# EAGLE design controller pcb (EAGLE 9.3.0)
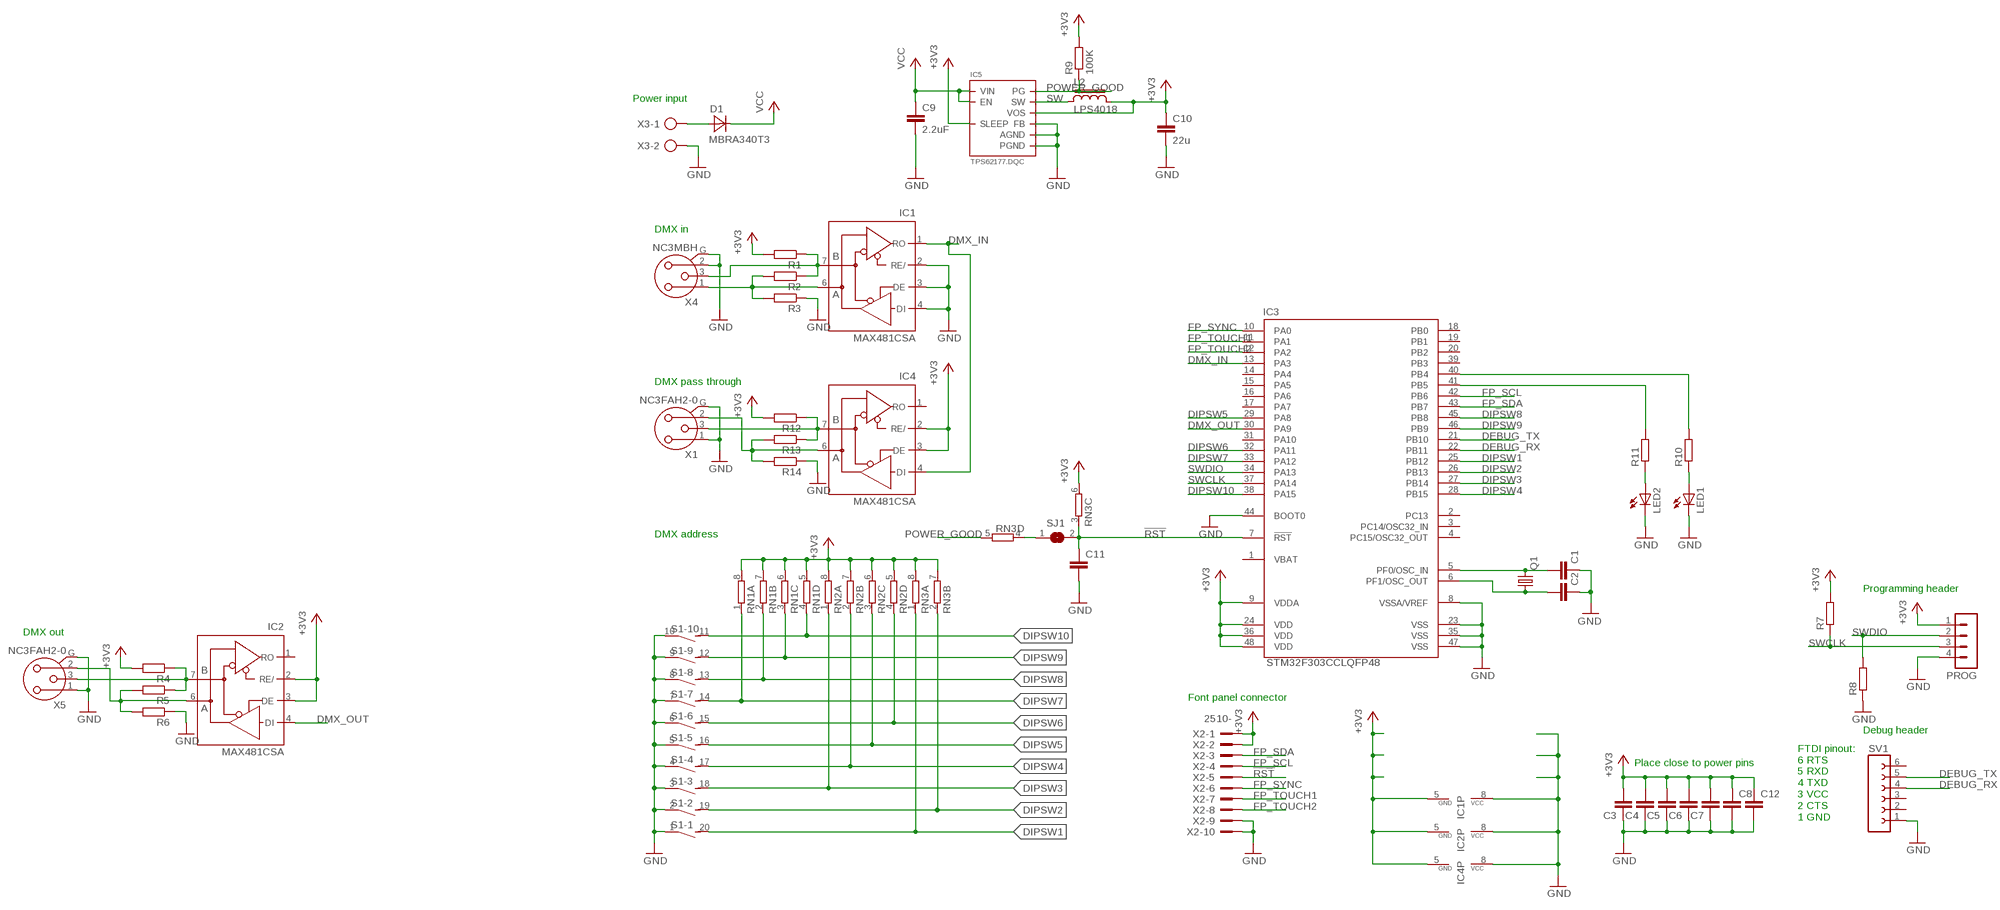
[diagram p0: schematic, sheet 1]

## Parts
C1  C-EUC0603K  [C0603K]
C2  C-EUC0603K  [C0603K]
C3  C-EUC0603K  [C0603K]
C4  C-EUC0603K  [C0603K]
C5  C-EUC0603K  [C0603K]
C6  C-EUC0603K  [C0603K]
C7  C-EUC0603K  [C0603K]
C8  C-EUC0603K  [C0603K]
C9  2.2uF  C-EUC1206  [C1206]
C10  22u  C-EUC1206  [C1206]
C11  C-EUC0603K  [C0603K]
C12  C-EUC0603K  [C0603K]
D1  MBRA340T3  [SMA]
IC1  MAX481CSA  [SO08]
IC2  MAX481CSA  [SO08]
IC3  STM32F303CCLQFP48  [LQFP48]
IC4  MAX481CSA  [SO08]
IC5  TPS62177.DQC  [DQC]
L2  LPS4018  [LPS4018]
LED1  LEDCHIPLED_1206  [CHIPLED_1206]
LED2  LEDCHIPLED_1206  [CHIPLED_1206]
PROG  MA04-1  [MA04-1]
Q1  CRYSTALCTS406  [CTS406]
R1  R-EU_R0603  [R0603]
R2  R-EU_R0603  [R0603]
R3  R-EU_R0603  [R0603]
R4  R-EU_R0603  [R0603]
R5  R-EU_R0603  [R0603]
R6  R-EU_R0603  [R0603]
R7  R-EU_R0603  [R0603]
R8  R-EU_R0603  [R0603]
R9  100K  R-EU_R0603  [R0603]
R10  R-EU_R0603  [R0603]
R11  R-EU_R0603  [R0603]
R12  R-EU_R0603  [R0603]
R13  R-EU_R0603  [R0603]
R14  R-EU_R0603  [R0603]
RN1  4R-NCAY16  [CAY16]
RN2  4R-NCAY16  [CAY16]
RN3  4R-NCAY16  [CAY16]
S1  DIP10SB  [DIP10SB]
SJ1  SJ  [SJ]
SV1  FE06-1  [FE06]
X1  NC3FAH2-0  [NC3FAH2-0]
X2  2510-  [PAK100/2500-10]
X3  AK500/2  [AK500/2]
X4  NC3MBH  [NC3MBH]
X5  NC3FAH2-0  [NC3FAH2-0]

## Nets
!RST: C11.1 IC3.7(!RST) RN3.3 SJ1.2 X2.5
+3V3: C3.2 C4.2 C5.2 C6.2 C7.2 C8.1 C10.1 C12.1 IC1.5(GND) IC2.2(RE/) IC2.3(DE) IC2.5(GND) IC3.9(VDDA) IC3.24(VDD) IC3.36(VDD) IC3.48(VDD) IC4.2(RE/) IC4.3(DE) IC4.5(GND) IC5.8(SLEEP) IC5.10(VOS) L2.2 PROG.1 R1.2 R4.2 R7.2 R9.2 R12.2 RN1.5 RN1.6 RN1.7 RN1.8 RN2.5 RN2.6 RN2.7 RN2.8 RN3.6 RN3.7 RN3.8 X2.1 X2.2
DEBUG_RX: IC3.22(PB11) SV1.4
DEBUG_TX: IC3.21(PB10) SV1.5
DIPSW1: IC3.25(PB12) RN3.1 S1.20
DIPSW2: IC3.26(PB13) RN3.2 S1.19
DIPSW3: IC3.27(PB14) RN2.1 S1.18
DIPSW4: IC3.28(PB15) RN2.2 S1.17
DIPSW5: IC3.29(PA8) RN2.3 S1.16
DIPSW6: IC3.32(PA11) RN2.4 S1.15
DIPSW7: IC3.33(PA12) RN1.1 S1.14
DIPSW8: IC3.45(PB8) RN1.2 S1.13
DIPSW9: IC3.46(PB9) RN1.3 S1.12
DIPSW10: IC3.38(PA15) RN1.4 S1.11
DMX_IN: IC1.1(RO) IC3.13(PA3) IC4.4(DI)
DMX_OUT: IC2.4(DI) IC3.30(PA9)
FP_SCL: IC3.42(PB6) X2.4
FP_SDA: IC3.43(PB7) X2.3
FP_SYNC: IC3.10(PA0) X2.6
FP_TOUCH1: IC3.11(PA1) X2.7
FP_TOUCH2: IC3.12(PA2) X2.8
GND: C1.1 C2.1 C3.1 C4.1 C5.1 C6.1 C7.1 C8.2 C9.2 C10.2 C11.2 C12.2 IC1.2(RE/) IC1.3(DE) IC1.4(DI) IC1.8(VCC) IC2.8(VCC) IC3.8(VSSA/VREF) IC3.23(VSS) IC3.35(VSS) IC3.44(BOOT0) IC3.47(VSS) IC4.8(VCC) IC5.1(PGND) IC5.5(FB) IC5.6(AGND) IC5.PAD(PGND) LED1.C LED2.C PROG.4 R3.1 R6.1 R8.1 R14.1 S1.1 S1.2 S1.3 S1.4 S1.5 S1.6 S1.7 S1.8 S1.9 S1.10 SV1.1 X1.1 X1.G X2.9 X2.10 X3.2 X4.2 X4.G X5.1 X5.G
N$1: D1.A X3.1
N$2: IC4.6(A) R13.2 R14.2 X1.2
N$3: IC1.7(B) R1.1 R2.1 X4.3
N$4: C2.2 IC3.6(PF1/OSC_OUT) Q1.1
N$5: C1.2 IC3.5(PF0/OSC_IN) Q1.3
N$6: IC1.6(A) R2.2 R3.2 X4.1
N$7: IC2.6(A) R5.2 R6.2 X5.2
N$8: IC2.7(B) R4.1 R5.1 X5.3
N$9: LED1.A R10.1
N$10: LED2.A R11.1
N$11: IC4.7(B) R12.1 R13.1 X1.3
N$12: IC3.41(PB5) R11.2
N$13: IC3.40(PB4) R10.2
N$14: RN3.4 SJ1.1
POWER_GOOD: IC5.7(PG) R9.1 RN3.5
SW: IC5.9(SW) L2.1
SWCLK: IC3.37(PA14) PROG.3 R7.1
SWDIO: IC3.34(PA13) PROG.2 R8.2
VCC: C9.1 D1.C IC5.2(VIN) IC5.3(EN)
Unconnected: IC2.1(RO) IC3.1(VBAT) IC3.2(PC13) IC3.3(PC14/OSC32_IN) IC3.4(PC15/OSC32_OUT) IC3.14(PA4) IC3.15(PA5) IC3.16(PA6) IC3.17(PA7) IC3.18(PB0) IC3.19(PB1) IC3.20(PB2) IC3.31(PA10) IC3.39(PB3) IC4.1(RO) SV1.2 SV1.3 SV1.6

## Notes on the sheet
- Power input
- DMX in
- DMX pass through
- DMX address
- Programming header
- DMX out
- Font panel connector
- Debug header
- Place close to power pins
- FTDI pinout:
  6 RTS
  5 RXD
  4 TXD
  3 VCC
  2 CTS
  1 GND

## Library data of the parts
C1-C12 = rcl:C-EU: CAPACITOR, European symbol; SPICEPREFIX: C
D1 = diode:MBRA340T3: Surface Mount Schottky Power Rectifier Source: http://www.onsemi.com/pub_link/Collateral/MBRA340T3-D.PDF
IC1 IC2 IC4 = maxim:MAX481CSA: RS485 TRANSEIVER; MF: MAXIM; MPN: MAX481CSA; OC_FARNELL: unknown; OC_NEWARK: 90C3817
IC3 = comp:STM32F303CC
IC5 = packages(ti):TPS62177
L2 = inductor-coilcraft:LPS4018: POWER INDUCTOR
LED1 LED2 = led:LED: LED OSRAM: - CHIPLED LG R971, LG N971, LY N971, LG Q971, LY Q971, LO R971, LY R971 LH N974, LH R974 LS Q976, LO Q976, LY Q976 LO Q996 - Hyper CHIPLED LW Q18S LB Q993, LB Q99A, LB R99A - SideLED LS A670, LO A670, LY A670, LG A670, LP A670 LB A673, LV A673, LT A673, LW A673 LH A674 LY A675 LS A676, LA A676, LO A676, LY A676, LW A676 LS A679, LY A679, LG A679 - Hyper Micro SIDELED® LS Y876, LA Y876, LO Y876, LY Y876 LT Y87S - SmartLED LW L88C, LW L88S LB L89C, LB L89S, LG L890 LS L89K, LO L89K, LY L89K LS L896, LA L896, LO L896, LY L896 - TOPLED LS T670, LO T670, LY T670, LG T670, LP T670 LSG T670, LSP T670, LSY T670, LOP T670, LYG T670 LG T671, LOG T671, LSG T671 LB T673, LV T673, LT T673, LW T673 LH T674 LS T676, LA T676, LO T676, LY T676, LB T676, LH T676, LSB T676, LW T676 LB T67C, LV T67C, LT T67C, LS T67K, LO T67K, LY T67K, LW E67C LS E67B, LA E67B, LO E67B, LY E67B, LB E67C, LV E67C, LT E67C LW T67C LS T679, LY T679, LG T679 LS T770, LO T770, LY T770, LG T770, LP T770 LB T773, LV T773, LT T773, LW T773 LH T774 LS E675, LA E675, LY E675, LS T675 LS T776, LA T776, LO T776, LY T776, LB T776 LHGB T686 LT T68C, LB T68C - Hyper Mini TOPLED® LB M676 - Mini TOPLED Santana® LG M470 LS M47K, LO M47K, LY M47K Source: http://www.osram.convergy.de LUXEON: - LUMILED® LXK2-PW12-R00, LXK2-PW12-S00, LXK2-PW14-U00, LXK2-PW14-V00 LXK2-PM12-R00, LXK2-PM12-S00, LXK2-PM14-U00 LXK2-PE12-Q00, LXK2-PE12-R00, LXK2-PE12-S00, LXK2-PE14-T00, LXK2-PE14-U00 LXK2-PB12-K00, LXK2-PB12-L00, LXK2-PB12-M00, LXK2-PB14-N00, LXK2-PB14-P00, LXK2-PB14-Q00 LXK2-PR12-L00, LXK2-PR12-M00, LXK2-PR14-Q00, LXK2-PR14-R00 LXK2-PD12-Q00, LXK2-PD12-R00, LXK2-PD12-S00 LXK2-PH12-R00, LXK2-PH12-S00 LXK2-PL12-P00, LXK2-PL12-Q00, LXK2-PL12-R00 Source: www.luxeon.com KINGBRIGHT: KA-3528ASYC Source: www.kingbright.com
PROG = con-lstb:MA04-1: PIN HEADER; OC_FARNELL: unknown; OC_NEWARK: unknown
Q1 = crystal:CRYSTAL: CRYSTAL; OC_FARNELL: unknown; OC_NEWARK: unknown
R1-R14 = rcl:R-EU_: RESISTOR, European symbol; SPICEPREFIX: R
RN1-RN3 = resistor-dil:4R-N: Array Chip Resistor Source: RS Component / Phycomp; OC_FARNELL: unknown; OC_NEWARK: unknown
S1 = switch-dil:DIP10SB: DIL/CODE SWITCH; OC_FARNELL: unknown; OC_NEWARK: unknown
SJ1 = jumper:SJ: SMD solder JUMPER
SV1 = con-lsta:FE06-1: FEMALE HEADER; OC_FARNELL: unknown; OC_NEWARK: unknown
X1 X5 = con-neutrik_ag:NC3: Neutrik Audio Connector XLR SERIES Stereo 1/4" jack Source: www.neutrik.com/; MPN: NC3FAH-2-0; OC_FARNELL: unknown; OC_NEWARK: 11J5829
X2 = con-3m:2510-: 3M (TM) Pak 100 4-Wall Header Source: 3M; MF: 3M; MPN: 2510-6002UB; OC_FARNELL: 9838244; OC_NEWARK: 46F4725
X3 = con-ptr500:AK500/2: CONNECTOR; OC_FARNELL: unknown; OC_NEWARK: unknown
X4 = con-neutrik_ag:NC3: Neutrik Audio Connector XLR SERIES Stereo 1/4" jack Source: www.neutrik.com/; MF: NEUTRIK; MPN: NC3MBH; OC_FARNELL: unknown; OC_NEWARK: 91F3470

## Board
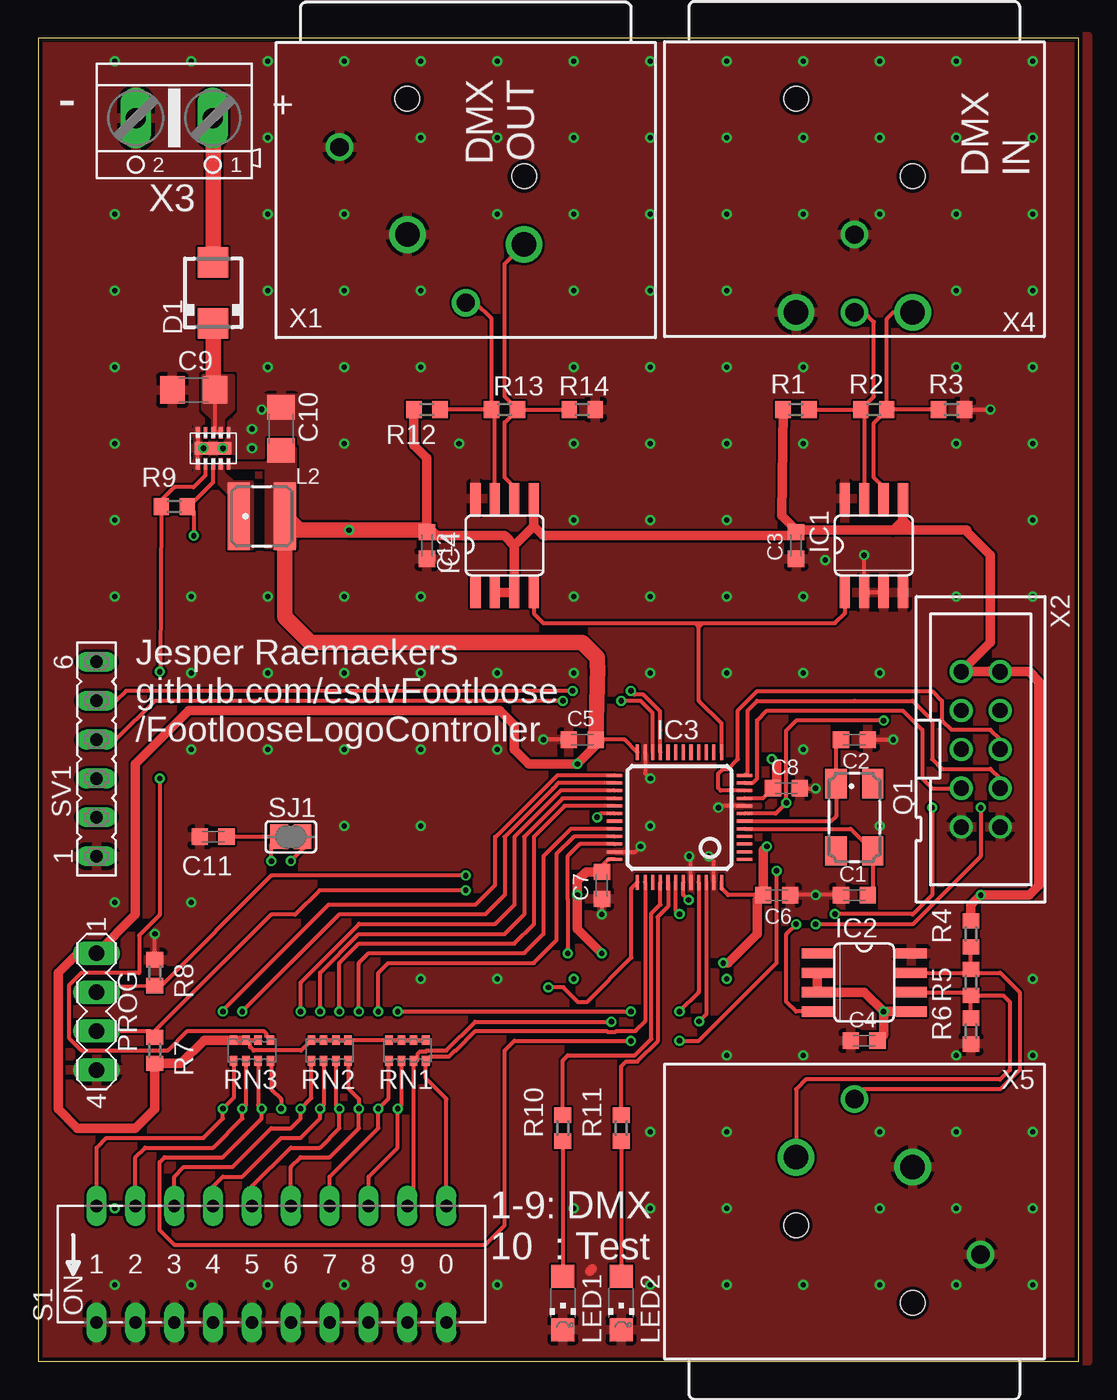
[diagram p1: board, top side]
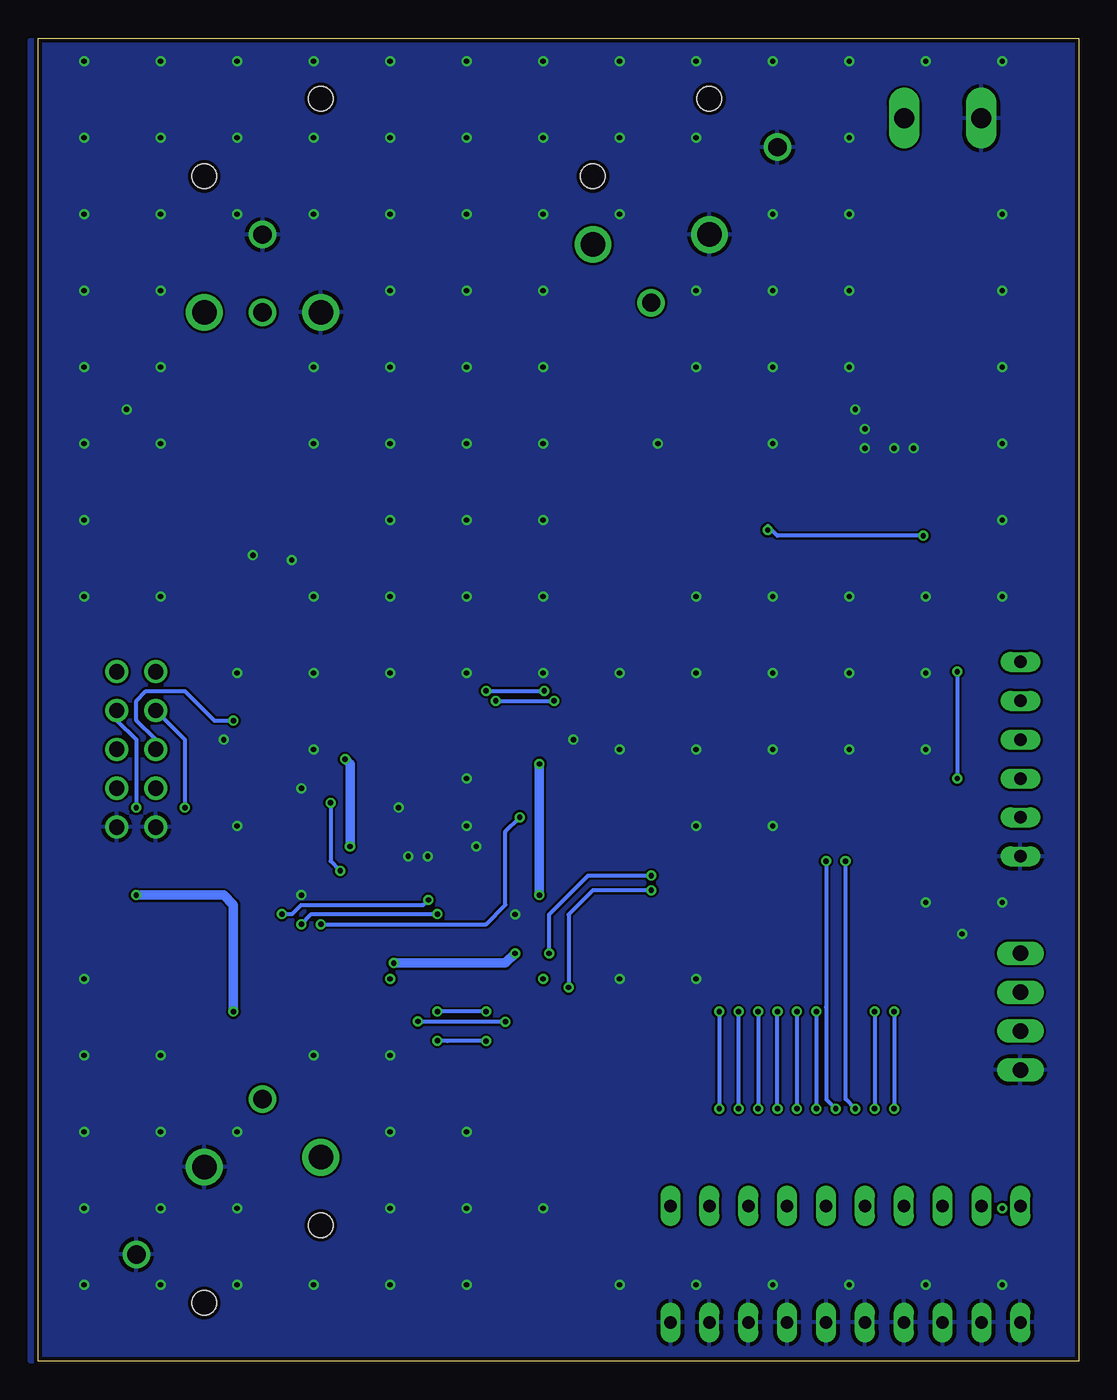
[diagram p2: board, bottom side, seen from below]

Size 68 x 86.5 mm. Coordinates in mm from the lower left corner, seen from the top.
Outline: 0,0 68,0 68,86.5 0,86.5 0,0
Copper layers (1*16): Top 0.035mm / dielectric 1.5mm / Bottom 0.035mm
Design rules "SeeedStudio_2layer_DRU_no_angle_20140221": minimum track width 6mil, minimum drill 12mil, track to track 6mil, track to pad 6mil, pad to pad 6mil, via to via 6mil, smd to smd 0mil, copper to edge 10mil, drill to drill 10mil, minimum pad ring 10mil, minimum via ring 6mil, stop-mask expansion 2mil, vias tented up to drill 100mil, thermal gap 10mil

### Footprints (pad centres in the part's own frame; a part is rotated, then mirrored left to right if it is on the bottom)
C0603K = smd 1.05 x 1.08: 1 -0.875,0; 2 0.875,0
C1206 = smd 1.6 x 1.8: 1 -1.4,0; 2 1.4,0
SMA = smd 2 x 2: A 2,0; C -2,0
SO08 = smd 0.66 x 2.032: 1 -1.905,-3.073; 2 -0.635,-3.073; 3 0.635,-3.073; 4 1.905,-3.073; 5 1.905,3.073; 6 0.635,3.073; 7 -0.635,3.073; 8 -1.905,3.073
LQFP48 = smd 0.2 x 1: 1 -2.75,-4.25; 2 -2.25,-4.25; 3 -1.75,-4.25; 4 -1.25,-4.25; 5 -0.75,-4.25; 6 -0.25,-4.25; 7 0.25,-4.25; 8 0.75,-4.25; 9 1.25,-4.25; 10 1.75,-4.25; 11 2.25,-4.25; 12 2.75,-4.25; 25 2.75,4.25; 26 2.25,4.25; 27 1.75,4.25; 28 1.25,4.25; 29 0.75,4.25; 30 0.25,4.25; 31 -0.25,4.25; 32 -0.75,4.25; 33 -1.25,4.25; 34 -1.75,4.25; 35 -2.25,4.25; 36 -2.75,4.25 | smd 1 x 0.2: 13 4.25,-2.75; 14 4.25,-2.25; 15 4.25,-1.75; 16 4.25,-1.25; 17 4.25,-0.75; 18 4.25,-0.25; 19 4.25,0.25; 20 4.25,0.75; 21 4.25,1.25; 22 4.25,1.75; 23 4.25,2.25; 24 4.25,2.75; 37 -4.25,2.75; 38 -4.25,2.25; 39 -4.25,1.75; 40 -4.25,1.25; 41 -4.25,0.75; 42 -4.25,0.25; 43 -4.25,-0.25; 44 -4.25,-0.75; 45 -4.25,-1.25; 46 -4.25,-1.75; 47 -4.25,-2.25; 48 -4.25,-2.75
DQC = smd 0.75 x 0.25: 1 -1.025,1; 2 -1.025,0.5; 3 -1.025,0; 4 -1.025,-0.5; 5 -1.025,-1; 6 1.025,-1; 7 1.025,-0.5; 8 1.025,0; 9 1.025,0.5; 10 1.025,1 | smd 0.84 x 2.4: PAD 0,0
LPS4018 = smd 1.45 x 4.4: 1 -1.5,0; 2 1.5,0
CHIPLED_1206 = smd 1.5 x 1.5: A 0,-1.75; C 0,1.75
MA04-1 = drill 1.016 long: 1 -3.81,0; 2 -1.27,0; 3 1.27,0; 4 3.81,0
CTS406 = smd 1.9 x 1.4: 1 -2.2,-1.2; 2 2.2,-1.2; 3 2.2,1.2; 4 -2.2,1.2
R0603 = smd 1 x 1.1: 1 -0.85,0; 2 0.85,0
CAY16 = smd 0.5 x 0.65: 1 -1.2,-0.675; 2 -0.4,-0.675; 3 0.4,-0.675; 4 1.2,-0.675; 5 1.2,0.675; 6 0.4,0.675; 7 -0.4,0.675; 8 -1.2,0.675
DIP10SB = drill 0.813 long: 1 -11.43,-3.81; 2 -8.89,-3.81; 3 -6.35,-3.81; 4 -3.81,-3.81; 5 -1.27,-3.81; 6 1.27,-3.81; 7 3.81,-3.81; 8 6.35,-3.81; 9 8.89,-3.81; 10 11.43,-3.81; 11 11.43,3.81; 12 8.89,3.81; 13 6.35,3.81; 14 3.81,3.81; 15 1.27,3.81; 16 -1.27,3.81; 17 -3.81,3.81; 18 -6.35,3.81; 19 -8.89,3.81; 20 -11.43,3.81
SJ = smd 1.168 x 1.6: 1 -0.762,0; 2 0.762,0
FE06 = drill 0.813 long: 1 -6.35,0; 2 -3.81,0; 3 -1.27,0; 4 1.27,0; 5 3.81,0; 6 6.35,0
NC3FAH2-0 = drill 1.6: 1 -3.81,0.635; 2 3.81,0 | drill 1.2: 3 0,-3.815; G -8.25,6.355 | hole 1.6: -3.81,9.525; 3.81,4.445
PAK100/2500-10 = drill 1 pad 1.422: 1 -5.08,-1.27; 2 -5.08,1.27; 3 -2.54,-1.27; 4 -2.54,1.27; 5 0,-1.27; 6 0,1.27; 7 2.54,-1.27; 8 2.54,1.27; 9 5.08,-1.27; 10 5.08,1.27
AK500/2 = drill 1.321 long: 1 -2.515,0; 2 2.515,0
NC3MBH = drill 1.6: 1 3.81,0; 2 -3.81,0 | drill 1.2: 3 0,0; G 0,5.08 | hole 1.6: -3.81,13.97; 3.81,8.89

### Placement (x,y rotation side)
C1  53.34,30.48 0 top
C2  53.34,40.64 180 top
C3  49.53,53.34 90 top
C4  53.98,20.95 0 top
C5  35.56,40.64 0 top
C6  48.26,30.48 180 top
C7  36.83,31.11 90 top
C8  48.9,37.47 0 top
C9  10.16,63.5 180 top
C10  15.88,60.96 90 top
C11  11.43,34.29 180 top
C12  25.4,53.34 270 top
D1  11.43,69.85 90 top
IC1  54.61,53.34 0 top
IC2  53.98,24.77 270 top
IC3  41.91,35.56 90 top
IC4  30.48,53.34 0 top
IC5  11.43,59.69 270 top
L2  14.61,55.24 0 top
LED1  34.29,3.81 180 top
LED2  38.1,3.81 180 top
PROG  3.81,22.86 270 top
Q1  53.34,35.56 270 top
R1  49.53,62.23 180 top
R2  54.61,62.23 0 top
R3  59.69,62.23 180 top
R4  60.96,27.94 90 top
R5  60.96,24.77 270 top
R6  60.96,21.59 90 top
R7  7.62,20.32 270 top
R8  7.62,25.4 270 top
R9  8.89,55.88 0 top
R10  34.29,15.24 90 top
R11  38.1,15.24 90 top
R12  25.4,62.23 180 top
R13  30.48,62.23 0 top
R14  35.56,62.23 180 top
RN1  24.13,20.32 0 top
RN2  19.05,20.32 0 top
RN3  13.97,20.32 0 top
S1  15.24,6.35 0 top
SJ1  16.51,34.29 180 top
SV1  3.81,39.37 90 top
X1  27.94,73.03 0 top
X2  61.59,40.01 270 top
X3  8.89,81.28 180 top
X4  53.34,68.58 0 top
X5  53.34,13.34 180 top

### Tracks (layer width: path | path; a pad name or v marks a point on that pad's centre or on a via)
!RST  (via drill 0.35)
  Top 0.254: v15.24,32.7 15.24,33.78 SJ1.2 C11.1 | RN3.3 14.37,16.75 v14.61,16.51 14.61,15.88 12.06,13.34 8.26,13.34 7.94,13.02 7.94,8.57 8.89,7.62 29.21,7.62 30.48,8.89 30.48,20.32 31.11,20.95 31.14,20.93 v38.73,20.93 | v41.91,20.95 43.18,20.95 48.26,26.04 v48.26,32.07 | IC3.7 48.19,35.81 v48.9,36.51 48.9,41.25 49.53,41.89 v55.24,41.89
  Bottom 0.254: v48.9,36.51 48.9,32.7 v48.26,32.07 | v14.61,16.51 15.24,17.14 v15.24,32.7 | v38.73,20.93 41.25,20.93 41.27,20.95 v41.91,20.95 | X2.5 60.33,40.64 61.59,41.91 61.59,43.18 60.96,43.81 58.42,43.81 56.49,41.89 v55.24,41.89
+3V3  (via drill 0.35)
  Top 0.254: RN1.5 RN1.6 RN1.7 RN1.8 RN2.5 RN2.6 RN2.7 RN2.8 17.18,20.32 14.07,20.32 13.84,20.55 13.84,20.72 RN3.7 RN3.6 | IC5.8 11.43,57.47 9.84,55.88 R9.2 10.16,55.56 v10.16,53.98 | IC3.48 44.66,30.91 45.09,30.48 C6.2 | IC3.24 38.33,40.64 C5.2 | IC3.36 37.26,32.81 36.83,32.38 C7.2 | IC3.9 47.37,36.81 C8.1 48.26,37.7 | IC4.3 31.11,50.8
  Top 0.61: C5.2 36.7,40.51 v35.24,39.05 32.07,39.05 31.11,40.01 31.11,41.59 30.16,42.55 9.84,42.55 6.35,39.05 6.35,29.21 PROG.1 2.59,26.67 1.32,25.4 1.32,16.51 2.54,15.24 6.35,15.24 7.62,16.51 R7.2 9.31,19.47 10.84,21 RN3.8 RN3.7 | v44.77,26.04 45.09,26.04 46.99,27.94 46.99,30.21 C6.2 47.38,33.41 v47.62,33.66 | R1.2 48.58,55.29 49.53,54.34 C3.2 | 57.15,54.34 60.69,54.34 60.64,54.29 62.23,52.7 62.23,46.99 X2.1 X2.2 64.77,45.09 65.41,44.45 65.41,31.11 64.77,30.48 v61.59,30.48 60.96,29.84 R4.2 | 57.15,54.34 55.88,54.34 | 55.88,54.34 49.66,54.34 C3.2 | v55.24,22.86 IC2.5 | C4.2 55.24,21.35 v55.24,22.86 | v55.24,22.86 53.98,24.13 IC2.3 IC2.2 | C12.1 25.8,54.22 26.04,53.98 30.48,53.98 31.11,53.34 | 31.11,50.8 31.11,53.34 | 32.38,54.61 IC4.5 | 31.11,53.34 32.38,54.61 | 32.38,54.61 33.02,53.98 49.29,53.98 C3.2 | IC1.5 56.52,54.98 | 56.52,54.98 55.88,54.34 | 56.52,54.98 57.15,54.34 | R12.2 24.55,59.91 25.4,59.05 25.4,54.47 25.27,54.34 | IC4.2 IC4.3 | v36.83,26.67 35.24,28.26 v35.24,30.48 35.24,31.43 35.8,31.99 C7.2 | v47.94,39.37 48.26,39.05 48.26,37.7
  Top 1.016: C5.2 36.56,45.38 36.52,45.41 36.52,46.03 35.56,46.99 17.78,46.99 16.11,48.66 L2.2 17.01,54.34 v20.32,54.34 25.27,54.34 C12.1
  Bottom 0.254: v10.16,53.98 19.68,53.98 20.32,54.61 v20.32,54.34
  Bottom 0.61: v44.77,26.04 37.47,26.04 v36.83,26.67 | v35.24,30.48 v35.24,39.05 | v61.59,30.48 55.88,30.48 55.24,29.84 v55.24,22.86 | v47.62,33.66 47.62,39.05 v47.94,39.37
  pour Top (no thermals): 14.92,53.21 14.92,58.42 12.51,58.42 12.51,58.74 14.92,58.74 15.88,59.69 16.76,59.69 16.76,53.21
DEBUG_RX  (via drill 0.35)
  Top 0.254: v38.1,43.18 39.37,43.18 40.16,42.39 IC3.22 | v34.29,43.18 7.62,43.18 5.08,40.64 SV1.4
  Bottom 0.254: v38.1,43.18 v34.29,43.18
DEBUG_TX  (via drill 0.35)
  Top 0.254: v38.73,43.84 38.73,43.81 38.96,43.59 39.54,43.59 40.64,42.48 40.64,41.27 40.66,41.26 IC3.21 | v34.92,43.84 5.74,43.84 5.08,43.18 SV1.5
  Bottom 0.254: v38.73,43.84 34.95,43.84 34.92,43.81 v34.92,43.84
DIPSW1  (via drill 0.35)
  Top 0.254: v12.06,22.86 12.06,22.95 18.96,29.84 28.57,29.84 29.84,31.11 29.84,34.29 29.91,34.29 33.92,38.31 IC3.25 | RN3.1 12.77,17.21 v12.06,16.51 12.06,15.88 10.79,14.61 4.45,14.61 3.81,13.97 S1.20
  Bottom 0.254: v12.06,22.86 v12.06,16.51
DIPSW2  (via drill 0.35)
  Top 0.254: v13.34,22.86 19.71,29.23 29.23,29.23 30.48,30.48 30.48,34.29 33.66,37.47 34,37.81 IC3.26 | RN3.2 13.57,16.75 v13.34,16.51 13.34,15.88 11.43,13.97 6.99,13.97 6.35,13.34 S1.19
  Bottom 0.254: v13.34,22.86 v13.34,16.51
DIPSW3  (via drill 0.35)
  Top 0.254: v17.14,22.86 17.14,24.77 20.98,28.6 29.87,28.6 31.11,29.84 31.11,34.29 34.13,37.31 IC3.27 | S1.18 8.89,12.06 9.53,12.7 12.7,12.7 15.24,15.24 16.51,15.24 17.14,15.88 v17.14,16.51 17.85,17.21 RN2.1
  Bottom 0.254: v17.14,22.86 v17.14,16.51
DIPSW4  (via drill 0.35)
  Top 0.254: v18.41,22.86 18.41,25.4 20.95,27.94 30.48,27.94 31.75,29.21 31.75,34.29 34.27,36.81 IC3.28 | RN2.2 18.65,16.75 v18.41,16.51 18.41,15.88 17.14,14.61 15.88,14.61 13.34,12.06 12.06,12.06 11.43,11.43 S1.17
  Bottom 0.254: v18.41,22.86 v18.41,16.51
DIPSW5  (via drill 0.35)
  Top 0.254: v19.68,22.86 19.68,26.04 20.95,27.3 31.11,27.3 32.38,28.57 32.38,34.29 34.41,36.31 IC3.29 | RN2.3 19.45,16.75 v19.68,16.51 19.68,15.24 18.41,13.97 16.51,13.97 13.97,11.43 S1.16
  Bottom 0.254: v19.68,16.51 v19.68,22.86
DIPSW6  (via drill 0.35)
  Top 0.254: S1.15 16.51,12.7 17.14,13.34 19.05,13.34 20.95,15.24 v20.95,16.51 20.95,17.14 20.25,17.85 RN2.4 | v20.95,22.86 20.95,26.04 21.61,26.69 31.77,26.69 33.02,27.94 33.02,33.02 34.81,34.81 IC3.32
  Bottom 0.254: v20.95,22.86 v20.95,16.51
DIPSW7  (via drill 0.35)
  Top 0.254: v22.23,22.86 22.23,25.4 22.86,26.04 32.38,26.04 33.88,27.53 33.88,33.19 34.95,34.26 35.01,34.31 IC3.33 | RN1.1 22.86,19.57 22.86,17.14 v22.23,16.51 22.23,15.24 19.05,12.06 S1.14
  Bottom 0.254: v22.23,16.51 v22.23,22.86
DIPSW8  (via drill 0.35)
  Top 0.254: v41.91,22.86 43.18,24.13 43.16,24.15 IC3.45 | RN1.2 23.73,16.75 v23.5,16.51 23.5,13.97 21.59,12.06 S1.13 | v23.5,22.86 v38.73,22.86
  Bottom 0.254: v23.5,22.86 v23.5,16.51 | v38.73,22.86 v41.91,22.86
DIPSW9  (via drill 0.35)
  Top 0.254: S1.12 24.53,10.56 RN1.3 24.73,19.64 24.8,19.72 24.8,20.09 24.96,20.25 25.33,20.25 25.4,20.32 26.67,20.32 28.55,22.2 v37.47,22.2 | v43.19,22.22 43.66,22.69 IC3.46
  Bottom 0.254: v37.47,22.2 43.17,22.2 v43.19,22.22
DIPSW10
  Top 0.254: S1.11 26.67,17.14 25.33,18.48 RN1.4 25.6,19.91 26.84,19.91 27.25,20.32 27.3,20.32 28.57,21.59 37.15,21.59 37.19,21.55 37.74,21.55 37.78,21.59 39.02,21.59 39.66,22.23 IC3.38
DMX_IN
  Top 0.254: IC1.1 52.7,48.9 52.07,48.26 43.43,48.26 | 42.93,48.26 33.02,48.26 32.38,48.9 IC4.4 | 42.93,48.26 43.18,48.26 | 43.18,48.26 43.43,48.26 | IC3.13 44.66,41.7 43.18,43.18 43.18,48.01 | 43.18,48.01 43.18,48.26 | 43.18,48.01 42.93,48.26 | 43.18,48.01 43.43,48.26
DMX_OUT  (via drill 0.35)
  Top 0.254: IC2.4 49.53,22.86 48.9,23.5 48.9,27.94 v49.53,28.57 | v36.53,35.56 36.78,35.81 IC3.30
  Bottom 0.254: v49.53,28.57 38.73,28.57 37.47,29.84 37.47,34.62 v36.53,35.56
FP_SCL  (via drill 0.35)
  Top 0.254: v61.59,36.2 61.59,33.02 57.15,28.57 v50.8,28.57 | v41.91,29.23 41.66,29.48 IC3.42
  Bottom 0.254: X2.4 62.87,41.91 61.59,40.64 v61.59,36.2 | v41.91,29.23 50.14,29.23 v50.8,28.57
FP_SDA  (via drill 0.35)
  Top 0.254: v52.07,29.23 57.13,29.23 57.15,29.21 58.42,30.48 v58.42,36.2 | v42.5,30.16 42.16,30.5 IC3.43
  Bottom 0.254: X2.3 58.42,40.64 v58.42,36.2 | v52.07,29.23 51.41,29.23 50.82,29.82 42.84,29.82 v42.5,30.16
FP_SYNC
  Top 0.254: IC3.10 44.6,37.31 44.45,37.47 44.45,38.42 44.77,38.73 45.09,38.73 45.72,39.37 45.72,42.55 46.99,43.81 58.42,43.81 59.05,43.18 59.05,41.91 59.69,41.27 62.23,41.27 62.87,40.64 X2.6
FP_TOUCH1
  Top 0.254: IC3.11 46.7,37.81 46.99,38.1 46.99,41.91 47.62,42.55 56.52,42.55 57.78,41.27 57.78,38.1 58.42,37.47 X2.7
FP_TOUCH2
  Top 0.254: IC3.12 46.35,38.51 46.35,42.55 46.99,43.18 53.34,43.18 57.15,43.18 58.42,41.91 58.42,39.37 59.05,38.73 62.23,38.73 62.87,38.1 X2.8
GND  (via drill 0.35)
  Top 0.254: C2.1 v55.88,40.64 | C1.1 v50.8,30.48 C6.1 | C5.1 v33.02,40.64 | R3.1 v62.23,62.23 | IC1.3 IC1.2 v53.98,52.7 | IC5.6 10.43,59.33 10.48,59.37 | 10.48,59.37 v10.79,59.69 | IC5.5 10.43,59.42 10.48,59.37 | R8.1 v7.62,27.94 | IC3.35 39.02,33.31 v39.37,33.66 | IC3.23 39.66,38.45 v40.01,38.1 | C7.1 v36.83,29.21 | IC3.8 44.56,36.31 v44.45,36.2 | C8.2 v50.8,37.47 | IC3.44 42.66,32.91 v42.55,33.02 | IC3.47 44.16,32.67 v43.81,33.02
  Top 0.61: 36.03,5.87 36.2,6.03 | 51.39,52.34 v51.44,52.39
  other vias: 12.06,59.69 14.61,62.23 13.97,60.96 13.97,59.69 5,85 10,85 15,85 15,80 20,85 25,85 30,85 35,85 40,85 45,85 50,85 55,85 60,85 65,85 65,80 60,80 55,80 50,80 45,80 40,80 35,80 30,80 25,80 65,75 60,75 55,75 50,75 45,75 40,75 35,75 30,75 20,75 15,75 5,75 5,70 5,65 15,65 15,70 20,65 20,70 25,70 25,65 35,65 35,70 40,70 40,65 45,70 45,65 50,65 60,65 60,70 65,70 65,65 5,60 5,55 5,50 10,50 15,50 20,50 25,50 35,50 20,60 27.5,60 35,60 40,60 40,55 35,55 40,50 45,50 45,60 50,60 45,55 50,50 60,60 65,60 65,55 65,50 60,50 10,45 15,45 10,40 15,40 20,40 25,40 30,40 20,45 25,45 30,45 35,45 40,45 45,45 50,45 50,40 55,45 5,5 10,5 15,5 20,5 25,5 30,5 5,30 10,30 20,35 25,35 25,25 30,25 35,10 40,5 45,5 50,5 55,5 60,5 65,5 65,10 65,15 60,15 60,10 55,10 55,15 45,15 45,10 40,10 40,15 45,20 50,20 60,20 65,20 65,25 55,35 40,35
  pour Bottom: 68.58,0 0,0 0,86.36 68.58,86.36
  pour Top (no thermals): 12.51,61.09 12.51,61.09 14.61,63.18 17.78,63.18 17.78,61.59 17.46,61.28 14.92,61.28 14.92,59.37 12.51,59.37
  pour Top (rank 6): 0,86.63 68.58,86.63 68.58,0 0,0
N$1
  Top 1.016: X3.1 11.43,81.25 D1.A
N$2
  Top 0.254: R13.2 R14.2 | IC4.6 31.11,57.15 30.48,57.78 30.48,61.38 R13.2 | R13.2 30.48,63.08 30.48,71.75 X1.2
N$3
  Top 0.254: R2.1 53.98,61.91 IC1.7 | R1.1 R2.1 | R2.1 54.61,63.08 54.61,67.94 53.98,68.58 X4.3
N$4
  Top 0.254: C2.2 52.14,40.44 Q1.1 52.14,35.63 51.82,35.31 IC3.6
N$5
  Top 0.254: C1.2 54.54,30.68 Q1.3 53.16,34.74 53.09,34.81 IC3.5
N$6
  Top 0.254: R2.2 55.39,62.13 54.61,61.35 54.61,57.78 55.24,57.15 IC1.6 | R3.2 R2.2 | R2.2 55.46,68.16 55.88,68.58 X4.1
N$7
  Top 0.254: IC2.6 60.74,24.13 R5.2 | R5.2 63.08,23.91 63.5,23.5 63.5,19.05 62.87,18.41 50.16,18.41 49.53,17.78 X5.2 | R6.2 R5.2
N$8
  Top 0.254: R5.1 60.74,25.4 IC2.7 | R5.1 61.17,25.4 62.87,25.4 64.14,24.13 64.14,19.05 62.87,17.78 53.97,17.78 X5.3 | R5.1 R4.1
N$9
  Top 0.254: R10.1 LED1.A
N$10
  Top 0.254: R11.1 LED2.A
N$11
  Top 0.254: IC4.7 29.84,62.02 R13.1 | R13.1 R12.1 | R13.1 29.63,68.16 28.57,69.22 28.57,69.21 X1.3
N$12
  Top 0.254: R11.2 38.1,19.28 38.42,19.6 39.16,19.6 40.47,20.91 40.47,29.04 41.16,29.73 IC3.41
N$13
  Top 0.254: R10.2 34.29,19.68 34.61,20 38.99,20 40.07,21.08 40.07,29.27 40.66,29.86 IC3.40
N$14  (via drill 0.35)
  Top 0.254: v16.51,32.7 17.46,33.66 17.46,34.1 SJ1.1 | RN3.4 15.24,19.57 15.24,17.78 15.88,17.14 v15.88,16.51
  Bottom 0.254: v16.51,32.7 16.51,23.16 16.49,23.13 16.49,17.12 v15.88,16.51
N$109  (via drill 0.35)
  other vias: 5,10
N$133  (via drill 0.35)
  other vias: 35,25
N$134  (via drill 0.35)
  other vias: 45,25
POWER_GOOD  (via drill 0.35)
  Top 0.254: IC5.7 10.93,57.92 10.16,57.15 8.89,57.15 7.94,56.2 R9.1 7.96,45.11 v7.94,45.09 | RN3.5 14.9,21.27 14.9,21.44 14.74,21.6 9.74,21.6 8.49,20.34 2.83,20.34 2.01,21.16 2.01,24.56 2.83,25.38 6.59,25.38 6.59,27.84 7.94,29.19 v7.94,38.1
  Bottom 0.254: v7.94,45.09 v7.94,38.1
SW
  pour Top (no thermals): 12.06,58.74 12.06,58.1 12.7,57.47 13.97,57.47 13.97,53.15 12.7,53.15 12.7,56.52 11.75,57.47 11.75,58.74
SWCLK  (via drill 0.35)
  Top 0.254: v33.34,24.45 34.31,24.45 35.29,23.47 35.83,23.47 38.76,26.4 38.76,30.91 IC3.37 | v27.94,30.8 18.38,30.8 16.79,29.21 15.24,29.21 7.62,21.59 R7.1 7.3,21.59 PROG.3
  Bottom 0.254: v27.94,30.8 31.75,30.8 33.34,29.21 v33.34,24.45
SWDIO  (via drill 0.35)
  Top 0.254: v34.61,26.67 34.61,30.18 34.59,30.21 34.59,33 35.4,33.81 IC3.34 | v27.94,31.75 15.24,31.75 7.94,24.45 R8.2 4.13,24.45 PROG.2
  Bottom 0.254: v34.61,26.67 34.61,29.21 32.07,31.75 v27.94,31.75
VCC
  Top 0.254: IC5.2 IC5.3 11.56,60.84 C9.1
  Top 1.016: D1.C 11.43,63.5 C9.1
  pour Top (no thermals): 11.43,60.96 11.43,61.59 10.79,62.23 10.79,64.45 12.7,64.45 12.7,62.23 12.06,61.59 12.06,60.64 11.43,60.64

### Text on the board
tNames: DMX / OUT | - | + | DMX / IN | Jesper Raemaekers / github.com/esdvFootloose / /FootlooseLogoController | 1-9: DMX / 10 : Test